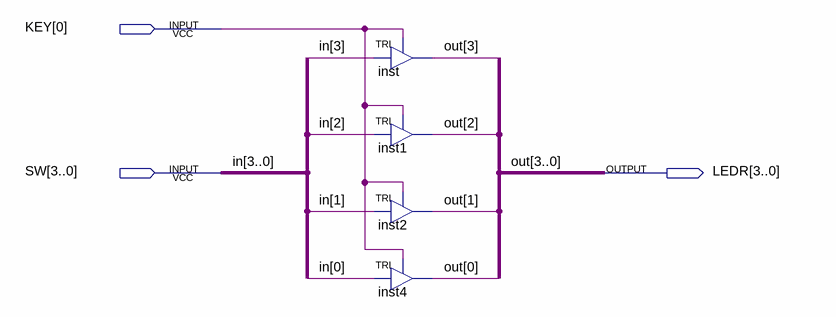
[diagram p0: schematic sheet]
// Quartus schematic Tristate4bits.bdf as structural Verilog: 4 symbols, 3 pins
module Tristate4bits (
  input  [0:0] KEY,
  input  [3:0] SW,
  output [3:0] LEDR
);

  TRI inst (.IN(SW[3]), .OE(KEY[0]), .OUT(LEDR[3]));
  TRI inst1 (.IN(SW[2]), .OE(KEY[0]), .OUT(LEDR[2]));
  TRI inst2 (.IN(SW[1]), .OE(KEY[0]), .OUT(LEDR[1]));
  TRI inst4 (.IN(SW[0]), .OE(KEY[0]), .OUT(LEDR[0]));

  // Other names for the same wires on the sheet: in[3:0] = SW; out[3:0] = LEDR
endmodule
